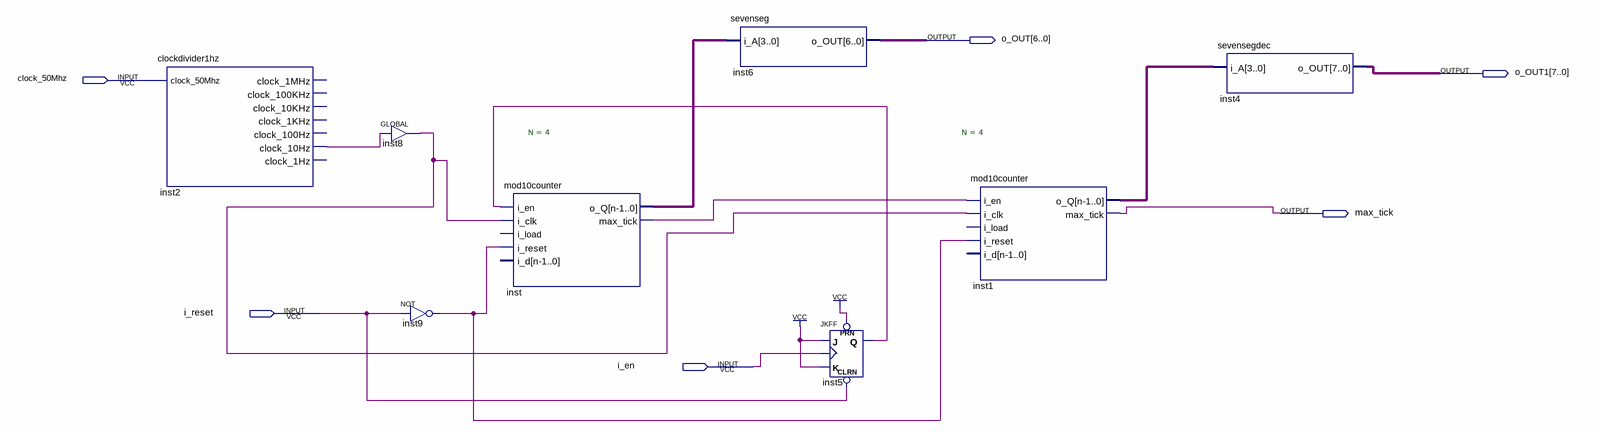
[diagram p0: schematic sheet]
// Quartus schematic 2digsyncounter.bdf as structural Verilog: 8 symbols, 6 pins
module \2digsyncounter  (
  input  clock_50Mhz,
  input  i_reset,
  input  i_en,
  output [6:0] o_OUT,
  output [7:0] o_OUT1,
  output max_tick
);

  wire inst2_clock_10hz, inst5_q, inst8_out, inst9_out, inst_max_tick;
  wire [3:0] inst1_o_q, inst_o_q;

  clockdivider1hz inst2 (
    .clock_50Mhz(clock_50Mhz), .clock_10Hz(inst2_clock_10hz));  // open: clock_1MHz, clock_100KHz, clock_10KHz, clock_1KHz, clock_100Hz, clock_1Hz
  GLOBAL inst8 (.IN(inst2_clock_10hz), .OUT(inst8_out));
  not inst9 (inst9_out, i_reset);
  mod10counter #(.N(4)) inst (
    .i_en(inst5_q), .i_clk(inst8_out), .i_reset(inst9_out), .o_Q(inst_o_q), .max_tick(inst_max_tick));  // open: i_load, i_d
  sevenseg inst6 (.i_A(inst_o_q), .o_OUT(o_OUT));
  JKFF inst5 (.PRN(1'b1), .CLRN(i_reset), .K(1'b1), .J(1'b1), .CLK(i_en), .Q(inst5_q));
  mod10counter #(.N(4)) inst1 (
    .i_en(inst_max_tick), .i_clk(inst8_out), .i_reset(inst9_out), .o_Q(inst1_o_q), .max_tick(max_tick));  // open: i_load, i_d
  sevensegdec inst4 (.i_A(inst1_o_q), .o_OUT(o_OUT1));
endmodule
